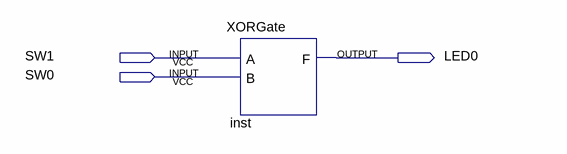
[diagram p0: schematic sheet]
// Quartus schematic P0Implementation.bdf as structural Verilog: 1 symbols, 3 pins
module P0Implementation (
  input  SW1,
  input  SW0,
  output LED0
);

  XORGate inst (.A(SW1), .B(SW0), .F(LED0));
endmodule
